# Altium schematic sheet Sheet2.SchDoc
size A3
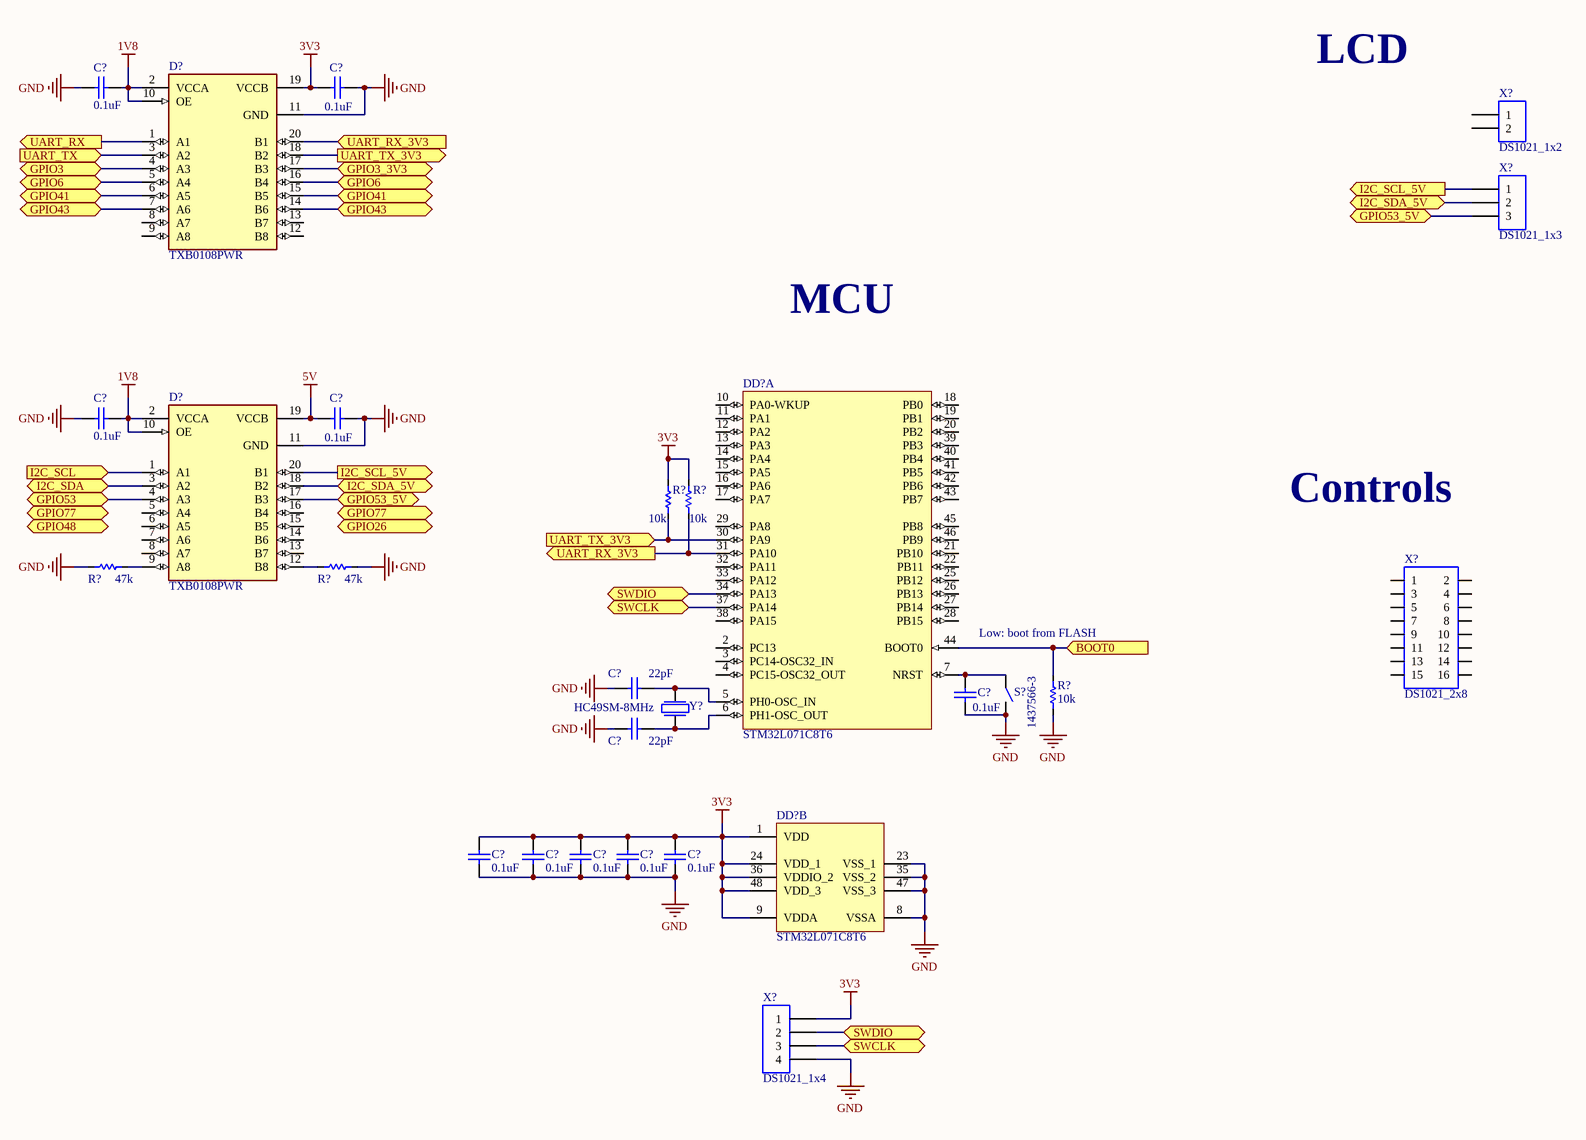
[diagram p0: Sheet2.SchDoc]

## Parts
(Parts that share a designator on the sheet are numbered #1, #2 ... from top to bottom, then left to right.)
C?#1  0.1uF  [C_SMD0603]
C?#2  0.1uF  [C_SMD0603]
C?#3  0.1uF  [C_SMD0603]
C?#4  0.1uF  [C_SMD0603]
C?#5  0.1uF  [C_SMD0603]
C?#6  22pF  [C_SMD0603]
C?#7  22pF  [C_SMD0603]
C?#8  0.1uF  [C_SMD0603]
C?#9  0.1uF  [C_SMD0603]
C?#10  0.1uF  [C_SMD0603]
C?#11  0.1uF  [C_SMD0603]
C?#12  0.1uF  [C_SMD0603]
D?#1  TXB0108PWR  [SOP65P640X120-20N]
D?#2  TXB0108PWR  [SOP65P640X120-20N]
DD?#1  STM32L071C8T6  [LQFP48_N]  (part A of 2)
DD?#2  STM32L071C8T6  [LQFP48_N]  (part B of 2)
R?#1  10k  [R_SMD0603]
R?#2  10k  [R_SMD0603]
R?#3  47k  [R_SMD0603]
R?#4  47k  [R_SMD0603]
R?#5  10k  [R_SMD0603]
S?  1437566-3  [1437566-3]
X?#1  DS1021_1x2  [PLD2]
X?#2  DS1021_1x3  [PLD1x3]
X?#3  DS1021_2x8  [PLD2X8]
X?#4  DS1021_1x4  [PLD1X4]
Y?  HC49SM-8MHz  [HC49SM]

## Ports
BOOT0 (in), GPIO3 (bidir), GPIO3_3V3 (bidir), GPIO6 (bidir), GPIO26 (bidir), GPIO41 (bidir), GPIO43 (bidir), GPIO48 (bidir), GPIO53 (bidir), GPIO53_5V (bidir), GPIO77 (bidir), I2C_SCL (in), I2C_SCL_5V (out), I2C_SDA (bidir), I2C_SDA_5V (bidir), SWCLK (bidir), SWDIO (bidir), UART_RX (out), UART_RX_3V3 (in), UART_RX_3V3 (out), UART_TX (in), UART_TX_3V3 (in), UART_TX_3V3 (out)

## Nets
1V8: C?#1.1 C?#3.1 D?#1.2(VCCA) D?#1.10(OE) D?#2.2(VCCA) D?#2.10(OE)
3V3: C?#2.2 C?#8.1 C?#9.1 C?#10.1 C?#11.1 C?#12.1 D?#1.19(VCCB) DD?#2.1(VDD) DD?#2.9(VDDA) DD?#2.24(VDD_1) DD?#2.36(VDDIO_2) DD?#2.48(VDD_3) R?#1.1(CCW) R?#2.1(CCW) X?#4.1
5V: C?#4.2 D?#2.19(VCCB)
GND: C?#1.2 C?#2.1 C?#3.2 C?#4.1 C?#5.2 C?#6.1 C?#7.1 C?#8.2 C?#9.2 C?#10.2 C?#11.2 C?#12.2 D?#1.11(GND) D?#2.11(GND) DD?#2.8(VSSA) DD?#2.23(VSS_1) DD?#2.35(VSS_2) DD?#2.47(VSS_3) R?#3.2(CW) R?#4.2(CW) R?#5.2(CW) S?.2 X?#4.4
BOOT0: DD?#1.44(BOOT0) R?#5.1(CCW) ; port BOOT0
GPIO3: D?#1.4(A3) ; port GPIO3
GPIO3_3V3: D?#1.17(B3) ; port GPIO3_3V3
GPIO6: D?#1.5(A4) D?#1.16(B4) ; port GPIO6
GPIO41: D?#1.6(A5) D?#1.15(B5) ; port GPIO41
GPIO43: D?#1.7(A6) D?#1.14(B6) ; port GPIO43
GPIO53: D?#2.4(A3) ; port GPIO53
GPIO53_5V: D?#2.17(B3) X?#2.3 ; port GPIO53_5V
I2C_SCL: D?#2.1(A1) ; port I2C_SCL
I2C_SCL_5V: D?#2.20(B1) X?#2.1 ; port I2C_SCL_5V
I2C_SDA: D?#2.3(A2) ; port I2C_SDA
I2C_SDA_5V: D?#2.18(B2) X?#2.2 ; port I2C_SDA_5V
SWCLK: DD?#1.37(PA14) X?#4.3 ; port SWCLK
SWDIO: DD?#1.34(PA13) X?#4.2 ; port SWDIO
UART_RX: D?#1.1(A1) ; port UART_RX
UART_RX_3V3: D?#1.20(B1) DD?#1.31(PA10) R?#2.2(CW) ; port UART_RX_3V3
UART_TX: D?#1.3(A2) ; port UART_TX
UART_TX_3V3: D?#1.18(B2) DD?#1.30(PA9) R?#1.2(CW) ; port UART_TX_3V3
NetC?#5_1: C?#5.1 DD?#1.7(NRST) S?.1
NetC?#6_2: C?#6.2 DD?#1.5(PH0-OSC_IN) Y?.2
NetC?#7_2: C?#7.2 DD?#1.6(PH1-OSC_OUT) Y?.1
NetD?#2_9: D?#2.9(A8) R?#4.1(CCW)
NetD?#2_12: D?#2.12(B8) R?#3.1(CCW)

Not connected (* = marked no-connect by the designer): D?#1 8(A7) 9(A8) 12(B8) 13(B7); D?#2 5(A4) 6(A5) 7(A6) 8(A7) 13(B7) 14(B6) 15(B5) 16(B4); DD?#1 2(PC13) 3(PC14-OSC32_IN) 4(PC15-OSC32_OUT) 10(PA0-WKUP) 11(PA1) 12(PA2) 13(PA3) 14(PA4) 15(PA5) 16(PA6) 17(PA7) 18(PB0) 19(PB1) 20(PB2) 21(PB10) 22(PB11) 25(PB12) 26(PB13) 27(PB14) 28(PB15) 29(PA8) 32(PA11) 33(PA12) 38(PA15) 39(PB3) 40(PB4) 41(PB5) 42(PB6) 43(PB7) 45(PB8) 46(PB9); X?#1 1 2; X?#3 1 2 3 4 5 6 7 8 9 10 11 12 13 14 15 16

## Notes on the sheet
- LCD
- MCU
- Controls
- Low: boot from FLASH
- Title
- Size:
- Date:
- A3
- Number:
- Time:
- Revision:
- Sheet
- of
- File:

## Library data of the parts
C?#1-C?#12 = C_SMD: SMD Capacitor
D?#1 D?#2 = TXB0108PWR: 8-Bit Bidirectional Voltage-Level Shifter with Auto Direction Sensing and +/-15-kV ESD Protect 20-TSSOP -40 to 85; MF: Texas Instruments; Package: TSSOP-20 Texas Instruments; Value: *; Check_prices: https://www.snapeda.com/parts/TXB0108PWR/Texas%20Instruments/view-part/45111/?ref=eda; Purchase-URL: https://pricing.snapeda.com/search/part/TXB0108PWR/?ref=eda; Availability: Warning; SnapEDA_Link: https://www.snapeda.com/parts/TXB0108PWR/Texas%20Instruments/view-part/45111/?ref=snap; Price: None; MP: TXB0108PWR; ComponentLink1Description: chipdip; ComponentLink1URL: https://www.chipdip.ru/product/txb0108pwr-2?from=suggest_product; ComponentLink2Description: elitan; ComponentLink2URL: https://www.elitan.ru/price/item525750
DD?#1 DD?#2 = STM32L071C8T6: MCU, 32BIT, 32MHZ, LQFP-48;  ARM Cortex-M0+; 32MHz; Program Memory Size:64KB; RAM Memory Size:20KB; 48Pins; MCU Case Style:LQFP; No. of I/O\'s:37I/O\'s; Embedded Interface Type:I2C, I2S, SPI, UART, USART; Supply Voltage Min:1.8V; Supply Voltage Max:3.6V;; PartNumber: STM32F103C8T6; A/D Converter: 2x12-bit (10 Channel); Core: ARM Cortex-M3; FLASH Size (Prog) (kB): 64; I/Os (High Current): 37; Internal RAM Size (kB): 20; Operating Frequency(F) (Processor speed) (MHz): 72; Packing: Tray; Supply Voltage(Vcc) min (V): 2; DatasheetVersion: Rev. 16; PackageVersion: Rev. 6, 06/2013; PackageReference: LQFP48; PackageDescription: 48-Pin Low Profile Quad Flat Package, 7 x 7 mm Body, 0.5 mm Pitch; Supplier 1: Digi-Key; Supplier Part Number 1: 497-6063-ND; Supplier 2: Farnell; Supplier Part Number 2: 1447637; Supplier 3: Newark; Supplier Part Number 3: 59M2182; Supplier 4: Newark; Supplier Part Number 4: 57P1222; Supplier 5: Mouser; Supplier Part Number 5: 511-STM32F103C8T6; Mounting Technology: Surface Mount; ComponentLink1Description: elitan; ComponentLink1URL: https://www.elitan.ru/price/item12343379; ComponentLink2Description: chipdip; ComponentLink2URL: https://www.chipdip.ru/product0/8001780702?from=suggest_product
R?#1-R?#5 = R_SMD: SMD Resistor
S? = 1437566-3: SMD button
X?#1 = DS1021_1x2: Вилка штыревая 2.54мм 1x2 прямая тип1
X?#2 = DS1021_1x3: Вилка штыревая 2.54мм 1x3 прямая тип1
X?#3 = DS1021_2x8: Вилка штыревая 2.54мм 2х8 прямая
X?#4 = DS1021_1x4: Вилка штыревая 2.54мм 1x4 прямая тип1
Y? = HC49SM: 8 MHz resonator